# Altium schematic sheet 08.RK3399 High speed.SchDoc
size A4; SheetNumber: 8; SheetTotal: 10
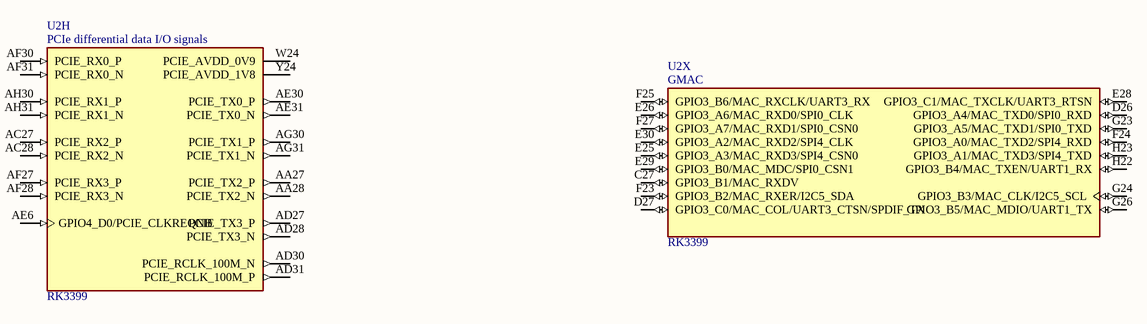
[diagram p0: 08.RK3399 High speed.SchDoc]

## Parts
U2  RK3399  [BGA828C65P31X31_2100X2100X161N]  (parts H,X of 32)

## Nets

Not connected (* = marked no-connect by the designer): U2 AA27(PCIE_TX2_P) AA28(PCIE_TX2_N) AC27(PCIE_RX2_P) AC28(PCIE_RX2_N) AD27(PCIE_TX3_P) AD28(PCIE_TX3_N) AD30(PCIE_RCLK_100M_N) AD31(PCIE_RCLK_100M_P) AE6(GPIO4_D0/PCIE_CLKREQNB) AE30(PCIE_TX0_P) AE31(PCIE_TX0_N) AF27(PCIE_RX3_P) AF28(PCIE_RX3_N) AF30(PCIE_RX0_P) AF31(PCIE_RX0_N) AG30(PCIE_TX1_P) AG31(PCIE_TX1_N) AH30(PCIE_RX1_P) AH31(PCIE_RX1_N) C27(GPIO3_B1/MAC_RXDV) D26(GPIO3_A4/MAC_TXD0/SPI0_RXD) D27(GPIO3_C0/MAC_COL/UART3_CTSN/SPDIF_TX) E25(GPIO3_A3/MAC_RXD3/SPI4_CSN0) E26(GPIO3_A6/MAC_RXD0/SPI0_CLK) E28(GPIO3_C1/MAC_TXCLK/UART3_RTSN) E29(GPIO3_B0/MAC_MDC/SPI0_CSN1) E30(GPIO3_A2/MAC_RXD2/SPI4_CLK) F23(GPIO3_B2/MAC_RXER/I2C5_SDA) F24(GPIO3_A0/MAC_TXD2/SPI4_RXD) F25(GPIO3_B6/MAC_RXCLK/UART3_RX) F27(GPIO3_A7/MAC_RXD1/SPI0_CSN0) G23(GPIO3_A5/MAC_TXD1/SPI0_TXD) G24(GPIO3_B3/MAC_CLK/I2C5_SCL) G26(GPIO3_B5/MAC_MDIO/UART1_TX) H22(GPIO3_B4/MAC_TXEN/UART1_RX) H23(GPIO3_A1/MAC_TXD3/SPI4_TXD) W24(PCIE_AVDD_0V9) Y24(PCIE_AVDD_1V8)

## Notes on the sheet
- (in symbol RK3399, part H) PCIe differential data I/O signals
- (in symbol RK3399, part X) GMAC

## Library data of the parts
U2 = RK3399: RK3399 ROCK Pi 4 Model A 2GB - ARMÂ® CortexÂ®-A53, CortexÂ®-A72 MPU Embedded Evaluation Board; MF: Rockchip; SnapEDA_Link: https://www.snapeda.com/parts/RK3399/Fuzhou+Rockchip+Electronics+Co/view-part/?ref=snap; Package: Seeed Technology; MP: RK3399; Check_prices: https://www.snapeda.com/parts/RK3399/Fuzhou+Rockchip+Electronics+Co/view-part/?ref=eda; Price: None; Value: *; Availability: Not in stock